# EAGLE design untitled (EAGLE 6.5.0)
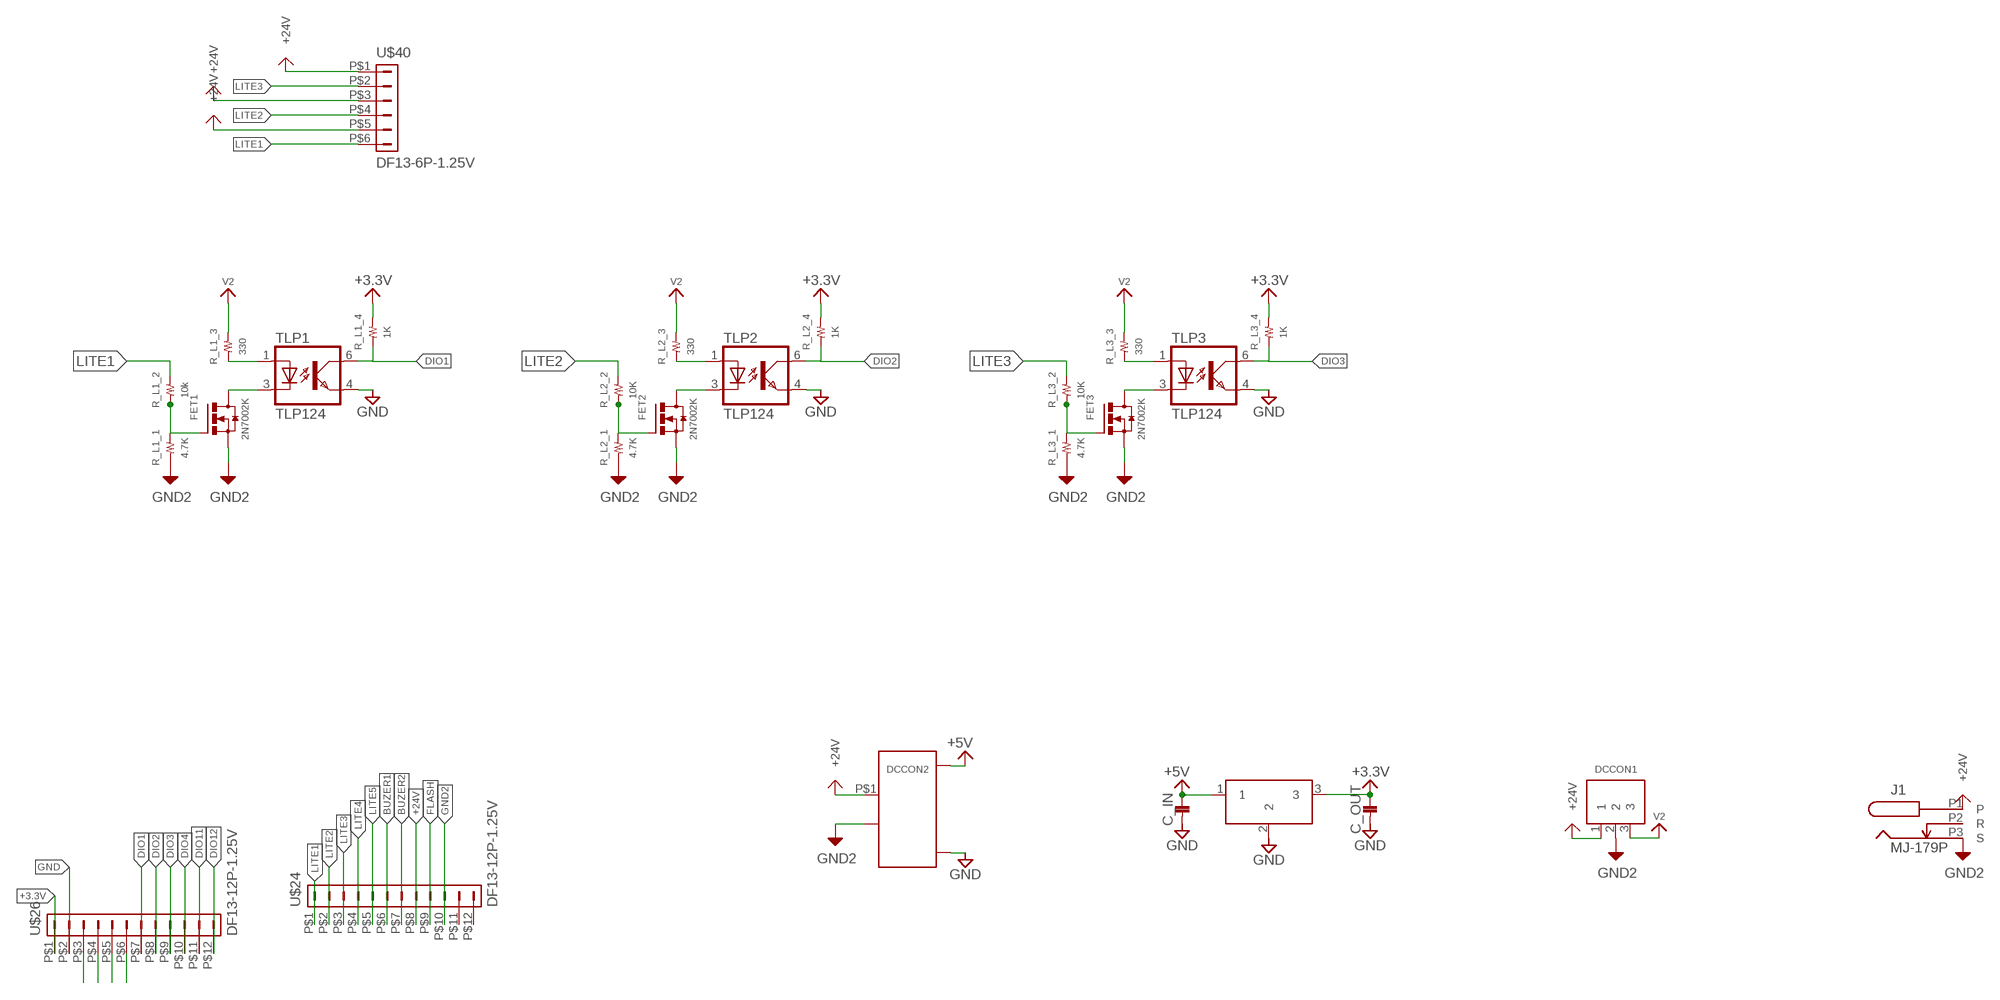
[diagram p0: schematic, sheet 1]

## Parts
C_IN  1608  [1608]
C_OUT  1608  [1608]
DCCON1  Ｒ－７８Ｅ５．０  [Ｒ－７８Ｅ５．０]
DCCON2  MAU100  [MAU]
FET1  2N7002K  CHIP_FET  [SOT23]
FET2  2N7002K  CHIP_FET  [SOT23]
FET3  2N7002K  CHIP_FET  [SOT23]
J1  MJ-179P  [MJ-179P]
R_L1_1  4.7K  RESISTOR__SMD  [1608]
R_L1_2  10k  RESISTOR__SMD  [1608]
R_L1_3  330  RESISTOR__SMD  [1608]
R_L1_4  1K  RESISTOR__SMD  [1608]
R_L2_1  4.7K  RESISTOR__SMD  [1608]
R_L2_2  10K  RESISTOR__SMD  [1608]
R_L2_3  330  RESISTOR__SMD  [1608]
R_L2_4  1K  RESISTOR__SMD  [1608]
R_L3_1  4.7K  RESISTOR__SMD  [1608]
R_L3_2  10K  RESISTOR__SMD  [1608]
R_L3_3  330  RESISTOR__SMD  [1608]
R_L3_4  1K  RESISTOR__SMD  [1608]
REGULATOR  NJM2845  [TO252]
TLP1  TLP124  [11−4C1]
TLP2  TLP124  [11−4C1]
TLP3  TLP124  [11−4C1]
U$24  DF13-12P-1.25V  [DF13C-12P-1.25V]
U$26  DF13-12P-1.25V  [DF13C-12P-1.25V]
U$40  DF13-6P-1.25V  [DF13C-6P-1.25V]

## Nets
2N7002K: FET1.1(G) R_L1_1.2 R_L1_2.1
+3.3V: C_OUT.P$1 R_L1_4.2 R_L2_4.2 R_L3_4.2 REGULATOR.3 U$26.P$1
+5V: C_IN.P$1 DCCON2.P$3(VO+) REGULATOR.1
+24V: DCCON1.1 DCCON2.P$1(VIN+) J1.P1(P) U$24.P$8 U$40.P$1 U$40.P$3 U$40.P$5
BUZER1: U$24.P$6
BUZER2: U$24.P$7
DIO1: R_L1_4.1 TLP1.6(COL) U$26.P$7
DIO2: R_L2_4.1 TLP2.6(COL) U$26.P$8
DIO3: R_L3_4.1 TLP3.6(COL) U$26.P$9
DIO4: U$26.P$10
DIO11: U$26.P$11
DIO12: U$26.P$12
FLASH: U$24.P$9
GND: C_IN.P$2 C_OUT.P$2 DCCON2.P$5(VO-) REGULATOR.2 TLP1.4(EMIT) TLP2.4(EMIT) TLP3.4(EMIT) U$26.P$2
GND2: DCCON1.2 DCCON2.P$2(VIN-) FET1.2(S) FET2.2(S) FET3.2(S) J1.P3(S) R_L1_1.1 R_L2_1.1 R_L3_1.1 U$24.P$10
LITE1: R_L1_2.2 U$24.P$1 U$40.P$6
LITE2: R_L2_2.2 U$24.P$2 U$40.P$4
LITE3: R_L3_2.2 U$24.P$3 U$40.P$2
LITE4: U$24.P$4
LITE5: U$24.P$5
N$1: FET2.3(D) TLP2.3(C)
N$2: FET1.3(D) TLP1.3(C)
N$3: R_L1_3.1 TLP1.1(A)
N$4: U$26.P$3
N$5: R_L2_3.1 TLP2.1(A)
N$6: FET2.1(G) R_L2_1.2 R_L2_2.1
N$7: FET3.3(D) TLP3.3(C)
N$8: R_L3_3.1 TLP3.1(A)
N$9: FET3.1(G) R_L3_1.2 R_L3_2.1
N$10: U$26.P$4
N$13: U$26.P$5
N$14: U$26.P$6
V2: DCCON1.3 R_L1_3.2 R_L2_3.2 R_L3_3.2
Unconnected: J1.P2(R) U$24.P$11 U$24.P$12

## Library data of the parts
C_IN C_OUT = 02_C:1608
DCCON1 = 04_IC:Ｒ－７８Ｅ５．０
DCCON2 = 04_IC:MAU100
FET1-FET3 = 06_FET:CHIP_FET
J1 = marushin:MJ-179P
R_L1_1-R_L1_4 R_L2_1-R_L2_4 R_L3_1-R_L3_4 = 01_R:RESISTOR__SMD
REGULATOR = 04_IC:NJM2845
TLP1-TLP3 = 04_IC:TLP124
U$24 U$26 = con-hirose-df13:DF13-12P-1.25: DF13-12P 1.25mm Pitch Miniature Crimping Connector.
U$40 = con-hirose-df13:DF13-6P-1.25: DF13-6P 1.25mm Pitch Miniature Crimping Connector.

## Net classes
0 default: clearance 0.205 mm

## Board
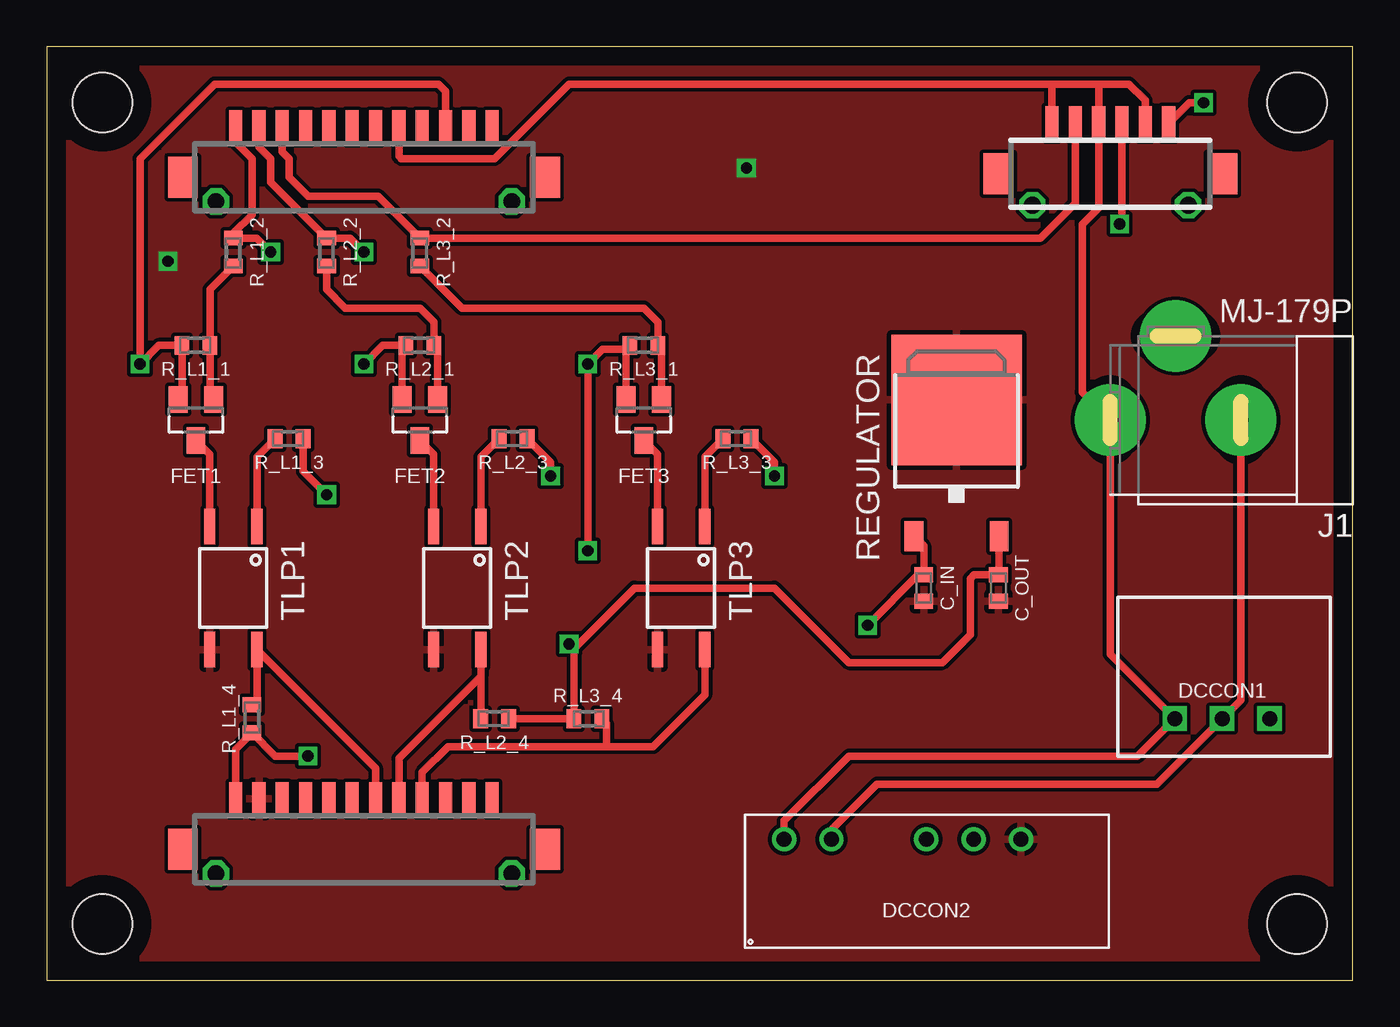
[diagram p1: board, top side]
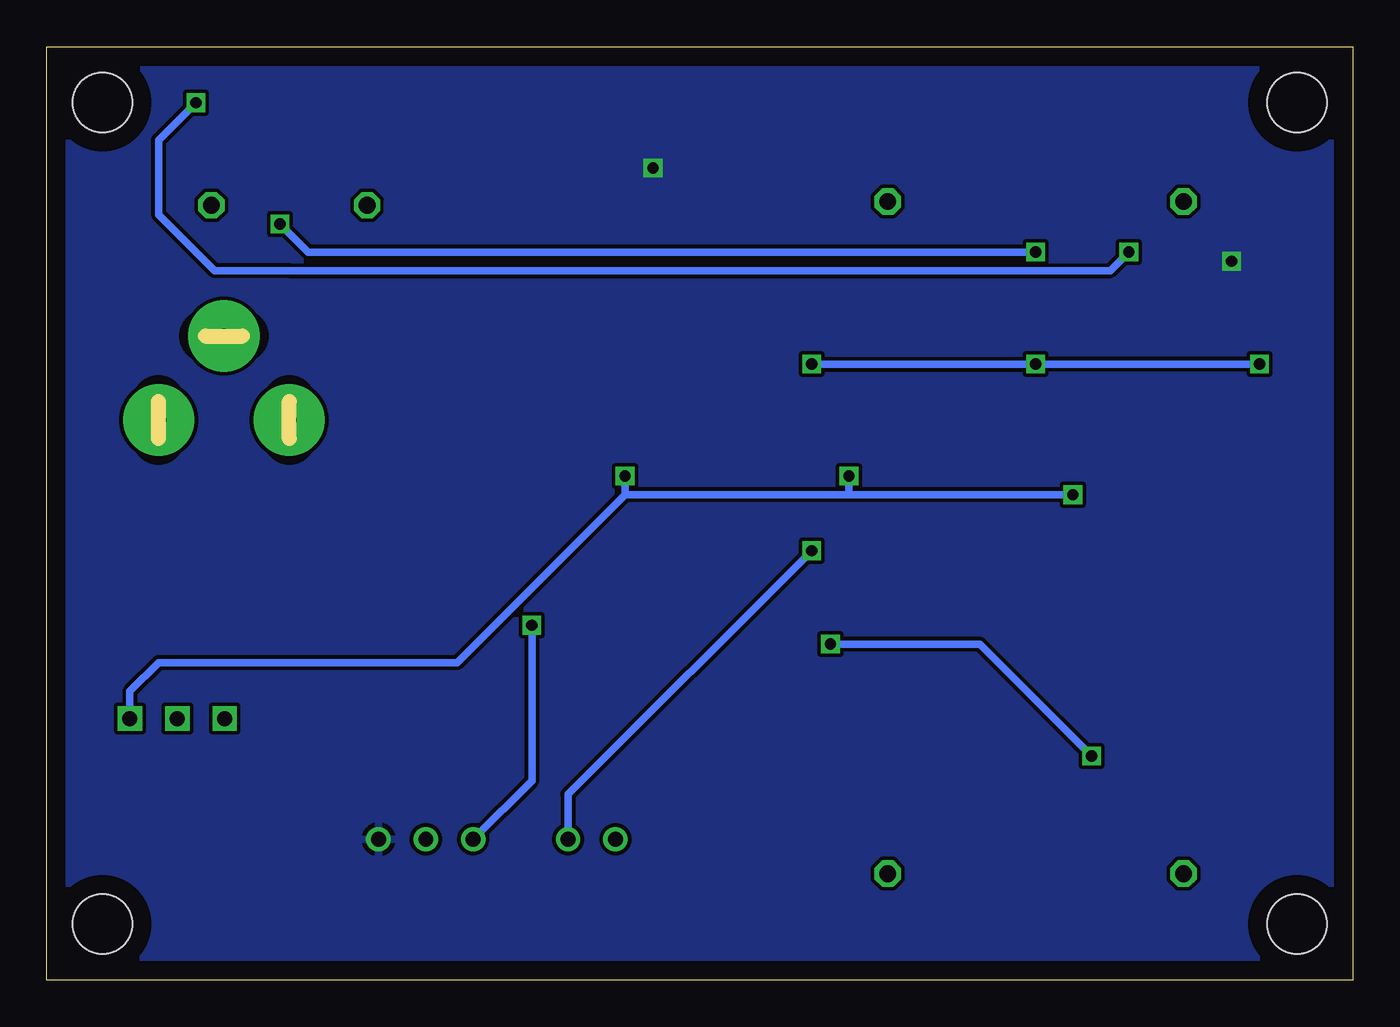
[diagram p2: board, bottom side, seen from below]

Size 70 x 50 mm. Coordinates in mm from the lower left corner, seen from the top.
Outline: 0,0 70,0 70,50 0,50 0,0
Copper layers (1*16): Top 0.035mm / dielectric 1.5mm / Bottom 0.035mm
Design rules "default *": minimum track width 10mil, minimum drill 0.5mm, track to track 8mil, track to pad 8mil, pad to pad 2mil, via to via 2mil, smd to smd 8mil, copper to edge 40mil, drill to drill 8mil, minimum pad ring 10mil, minimum via ring 8mil, stop-mask expansion 4mil, vias tented up to drill 0mil, thermal gap 10mil
Holes 3.2 mm at 3,47 67,47 67,3 3,3

### Footprints (pad centres in the part's own frame; a part is rotated, then mirrored left to right if it is on the bottom)
1608 = smd 0.8 x 1: P$1 -0.7,0; P$2 0.7,0
Ｒ－７８Ｅ５．０ = drill 0.8 square: 1 -2.54,0; 2 0,0; 3 2.54,0
MAU = drill 0.8: P$1 0,0; P$2 2.54,0; P$3 7.62,0; P$4 10.16,0; P$5 12.7,0
SOT23 = smd 1 x 1.4: 1 -0.95,-1.1; 2 0.95,-1.1; 3 0,1.1
MJ-179P = drill 0.8 pad 3.81: P1 7,0; P2 3.5,-4.5; P3 0,0
1608' = smd 0.8 x 1: 1 -0.75,0; 2 0.75,0
TO252 = smd 1 x 1.6: 1 -2.52,-6.22; 3 2.04,-6.22 | smd 7 x 7: 2 -0.24,1.08
11−4C1 = smd 0.6 x 1.9: 1 -1.27,-3.3; 3 1.27,-3.3; 4 1.27,3.3; 6 -1.27,3.3
DF13C-12P-1.25V = drill 0.9 octagon: G1 -7.925,-1.3; G2 7.925,-1.3 | smd 1.6 x 2.2: M$0 9.7,0; M$1 -9.7,0 | smd 0.7 x 1.8: P$1 -6.875,2.7; P$2 -5.625,2.7; P$3 -4.375,2.7; P$4 -3.125,2.7; P$5 -1.875,2.7; P$6 -0.625,2.7; P$7 0.625,2.7; P$8 1.875,2.7; P$9 3.125,2.7; P$10 4.375,2.7; P$11 5.625,2.7; P$12 6.875,2.7
DF13C-6P-1.25V = drill 0.9 octagon: G1 -4.175,-3.5; G2 4.175,-3.5 | smd 1.6 x 2.2: M$0 6,-1.8; M$1 -6,-1.8 | smd 0.7 x 1.8: P$1 -3.125,0.9; P$2 -1.875,0.9; P$3 -0.625,0.9; P$4 0.625,0.9; P$5 1.875,0.9; P$6 3.125,0.9

### Placement (x,y rotation side)
C_IN  47,21 270 top
C_OUT  51,21 270 top
DCCON1  63,14 0 top
DCCON2  39.52,7.54 0 top
FET1  8,30 180 top
FET2  20,30 180 top
FET3  32,30 180 top
J1  64,30 180 top
R_L1_1  4.7K  [1608']  8,34 0 top
R_L1_2  10k  [1608']  10,39 90 top
R_L1_3  330  [1608']  13,29 0 top
R_L1_4  1K  [1608']  11,14 270 top
R_L2_1  4.7K  [1608']  20,34 0 top
R_L2_2  10K  [1608']  15,39 90 top
R_L2_3  330  [1608']  25,29 0 top
R_L2_4  1K  [1608']  24,14 0 top
R_L3_1  4.7K  [1608']  32,34 0 top
R_L3_2  10K  [1608']  20,39 90 top
R_L3_3  330  [1608']  37,29 0 top
R_L3_4  1K  [1608']  29,14 180 top
REGULATOR  49,30 0 top
TLP1  10,21 180 top
TLP2  22,21 180 top
TLP3  34,21 180 top
U$24  17,43 0 top
U$26  17,7 0 top
U$40  57,45 0 top

### Tracks (layer width: path | path; a pad name or v marks a point on that pad's centre or on a via)
2N7002K
  Top 0.4: FET1.1 8.75,31.3 R_L1_1.2 8.75,37 R_L1_2.1
+3.3V  (via drill 0.6)
  Top 0.4: U$26.P$1 10.12,12.38 R_L1_4.2 12.25,12 v14,12 | R_L2_4.2 R_L3_4.2 28.25,17.75 | v28,18 28.25,17.75 | 28.25,17.75 31.5,21 39,21 43,17 48,17 49.5,18.5 49.5,21.5 49.7,21.7 C_OUT.P$1 51.04,21.74 REGULATOR.3
  Bottom 0.4: v14,12 20,18 v28,18
+5V  (via drill 0.6)
  Top 0.4: REGULATOR.1 47,23.26 C_IN.P$1 46.7,21.7 v44,19
  Bottom 0.4: DCCON2.P$3 44,10.68 v44,19
+24V
  Top 0.4: U$40.P$5 58.88,47.12 58,48 56.38,48 | 56.38,48 54,48 | U$40.P$1 53.88,47.88 54,48 | 56.38,48 U$40.P$3 56.38,41.38 55.5,40.5 55.5,31.5 J1.P1 57,17.46 DCCON1.1 58.46,12 43,12 39.52,8.52 DCCON2.P$1 | 54,48 28,48 24,44 19,44 18.88,44.12 U$24.P$8
DIO1
  Top 0.4: U$26.P$7 17.62,11.35 TLP1.6 11.27,15.02 R_L1_4.1
DIO2
  Top 0.3: R_L2_4.1 23.27,14.02
  Top 0.4: TLP2.6 23.27,16.27 | 23.27,16.27 18.88,11.88 U$26.P$8 | 23.27,14.02 23.27,16.27
DIO3
  Top 0.4: TLP3.6 35.27,15.27 32.5,12.5 30,12.5 | 30,12.5 21.5,12.5 20.12,11.12 U$26.P$9 20.12,10.12 | R_L3_4.1 30,13.75 30,12.5
GND  (via drill 0.6)
  other vias: 37.5,43.5 6.5,38.5
  pour Top: 0,50 70,50 70,0 0,0
  pour Bottom: 0,50 70,50 70,0 0,0
GND2  (via drill 0.6)
  Top 0.4: FET1.2 7.25,31.3 R_L1_1.1 6,34 v5,33 5,44 9,48 21,48 21.38,47.62 U$24.P$10 | FET2.2 19.05,33.8 R_L2_1.1 18,34 v17,33 | FET3.2 31.05,33.8 | 31.05,33.8 R_L3_1.1 | 31.05,33.8 29.8,33.8 v29,33 v29,23 | DCCON2.P$2 42.06,8.06 44.5,10.5 59.5,10.5 DCCON1.2 64,15 J1.P3
  Bottom 0.4: v5,33 v17,33 v29,33 | v29,23 42.06,9.94 DCCON2.P$2
LITE1  (via drill 0.6)
  Top 0.4: U$24.P$1 10.12,44.88 11,44 11,41 10,40 R_L1_2.2 11.25,39.75 v12,39
  Top 0.406: v62,47 61.23,47 U$40.P$6
  Bottom 0.4: 57,38 13,38 v12,39
  Bottom 0.406: 57,38 61,38 64,41 64,45 v62,47
LITE2  (via drill 0.6)
  Top 0.4: U$24.P$2 11.38,44.62 12,44 12,42.75 R_L2_2.2 16.25,39.75 v17,39
  Top 0.406: v57.5,40.5 57.62,40.62 U$40.P$4
  Bottom 0.4: v17,39 56,39 v57.5,40.5
LITE3
  Top 0.4: U$24.P$3 12.62,44.38 13,44 13,43 14,42 17.75,42 R_L3_2.2 53.25,39.75 55.12,41.62 U$40.P$2
N$1
  Top 0.4: TLP2.3 20.73,28.17 FET2.3
N$2
  Top 0.4: TLP1.3 8.73,28.17 FET1.3
N$3
  Top 0.4: TLP1.1 11.27,28.02 R_L1_3.1
N$5
  Top 0.4: TLP2.1 23.27,28.02 R_L2_3.1
N$6
  Top 0.4: R_L2_2.1 15,37 16,36 20,36 20.75,35.25 R_L2_1.2 20.95,33.8 FET2.1
N$7
  Top 0.4: TLP3.3 32.73,28.17 FET3.3
N$8
  Top 0.4: TLP3.1 35.27,28.02 R_L3_3.1
N$9
  Top 0.4: R_L3_2.1 22.25,36 32,36 32.75,35.25 R_L3_1.2 32.95,33.8 FET3.1
V2  (via drill 0.6)
  Top 0.4: R_L1_3.2 13.75,27.25 v15,26 | R_L2_3.2 27,27.75 v27,27 | R_L3_3.2 39,27.75 v39,27
  Bottom 0.4: v15,26 27,26 | 27,26 39,26 | 39,26 48,17 64,17 65.54,15.46 DCCON1.3 | v27,27 27,26 | v39,27 39,26